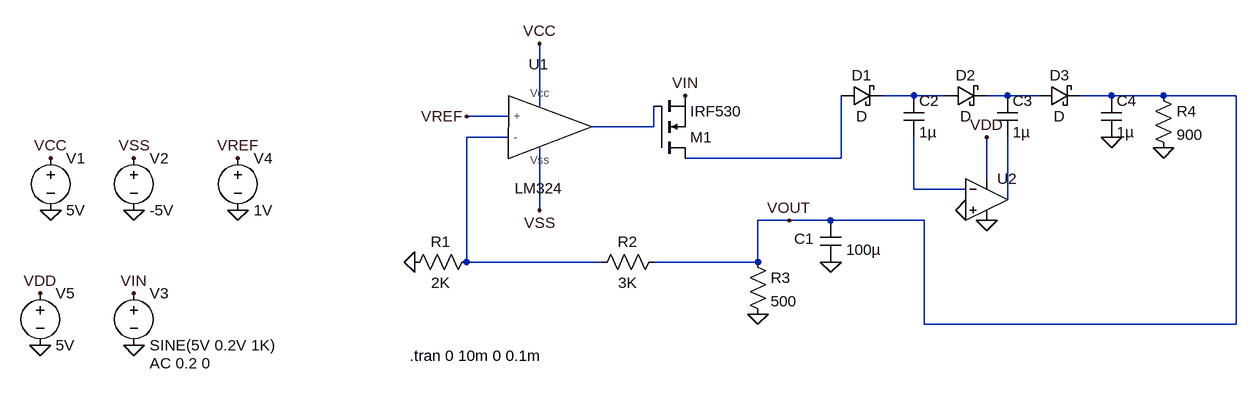
[diagram p0: schematic BAI 7 CHUAN BI 3.asc]
BAI 7 CHUAN BI 3.asc, the LTspice schematic file:
Version 4.1
SHEET 1 1780 680
WIRE 1280 -64 1232 -64
WIRE 1328 -64 1280 -64
WIRE 1424 -64 1392 -64
WIRE 1472 -64 1424 -64
WIRE 1584 -64 1536 -64
WIRE 1664 -64 1584 -64
WIRE 1776 -64 1664 -64
WIRE 704 -48 704 -144
WIRE 656 -32 592 -32
WIRE 880 -16 880 -48
WIRE 880 -16 784 -16
WIRE 656 0 592 0
WIRE 1168 32 1168 -64
WIRE 1168 32 928 32
WIRE 1392 64 1392 0
WIRE 1280 80 1280 0
WIRE 1360 80 1280 80
WIRE 1424 96 1424 0
WIRE 704 112 704 16
WIRE 1088 128 1040 128
WIRE 1152 128 1088 128
WIRE 1296 128 1152 128
WIRE 592 192 592 0
WIRE 800 192 592 192
WIRE 1040 192 1040 128
WIRE 1040 192 880 192
WIRE 1296 288 1296 128
WIRE 1776 288 1776 -64
WIRE 1776 288 1296 288
FLAG -48 112 0
FLAG -64 320 0
FLAG 80 320 0
FLAG 80 112 0
FLAG 240 112 0
FLAG -48 32 VCC
FLAG 80 32 VSS
FLAG 240 32 VREF
FLAG -64 240 VDD
FLAG 80 240 VIN
FLAG 512 192 0
FLAG 592 -32 VREF
FLAG 704 -144 VCC
FLAG 704 112 VSS
FLAG 1040 272 0
FLAG 1152 192 0
FLAG 1088 128 VOUT
FLAG 928 -64 VIN
FLAG 1584 0 0
FLAG 1664 16 0
FLAG 1392 0 VDD
FLAG 1392 128 0
FLAG 1360 112 0
SYMBOL voltage -48 16 R0
SYMATTR InstName V1
SYMATTR Value 5V
SYMBOL voltage 80 16 R0
SYMATTR InstName V2
SYMATTR Value -5V
SYMBOL voltage 80 224 R0
WINDOW 123 24 124 Left 2
WINDOW 39 0 0 Left 0
SYMATTR Value2 AC 0.2 0
SYMATTR InstName V3
SYMATTR Value SINE(5V 0.2V 1K)
SYMBOL voltage 240 16 R0
SYMATTR InstName V4
SYMATTR Value 1V
SYMBOL voltage -64 224 R0
SYMATTR InstName V5
SYMATTR Value 5V
SYMBOL res 496 208 R270
WINDOW 0 32 56 VTop 2
WINDOW 3 0 56 VBottom 2
SYMATTR InstName R1
SYMATTR Value 2K
SYMBOL LM324 704 -16 R0
SYMATTR InstName U1
SYMBOL res 896 176 R90
WINDOW 0 0 56 VBottom 2
WINDOW 3 32 56 VTop 2
SYMATTR InstName R2
SYMATTR Value 3K
SYMBOL res 1024 176 R0
SYMATTR InstName R3
SYMATTR Value 500
SYMBOL cap 1136 128 R0
WINDOW 0 -40 28 Left 2
WINDOW 3 40 45 Left 2
SYMATTR InstName C1
SYMATTR Value 100µ
SYMBOL nmos 880 32 M180
SYMATTR InstName M1
SYMATTR Value IRF530
SYMBOL schottky 1168 -48 R270
WINDOW 0 32 32 VTop 2
WINDOW 3 0 32 VBottom 2
SYMATTR InstName D1
SYMBOL cap 1264 -64 R0
SYMATTR InstName C2
SYMATTR Value 1µ
SYMBOL cap 1568 -64 R0
SYMATTR InstName C4
SYMATTR Value 1µ
SYMBOL res 1648 -80 R0
SYMATTR InstName R4
SYMATTR Value 900
SYMBOL cap 1408 -64 R0
SYMATTR InstName C3
SYMATTR Value 1µ
SYMBOL schottky 1328 -48 R270
WINDOW 0 32 32 VTop 2
WINDOW 3 0 32 VBottom 2
SYMATTR InstName D2
SYMBOL schottky 1472 -48 R270
WINDOW 0 32 32 VTop 2
WINDOW 3 0 32 VBottom 2
SYMATTR InstName D3
SYMBOL OpAmps\\UniversalOpAmp2 1392 96 R0
SYMATTR InstName U2
TEXT 504 336 Left 2 !.tran 0 10m 0 0.1m

The netlist it stands for:
* BAI 7 CHUAN BI 3.asc
V1 VCC 0 5V
V2 VSS 0 -5V
V3 VIN 0 SINE(5V 0.2V 1K) AC 0.2 0
V4 VREF 0 1V
V5 VDD 0 5V
R1 0 N004 2K
X§U1 VREF N004 VCC VSS N003 LM324  ; pins + - Vcc Vss ?
R2 VOUT N004 3K
R3 VOUT 0 500
C1 VOUT 0 100µ
M1 N005 N003 VIN VIN IRF530
D1 N005 N001 D
C2 N001 N006 1µ
C4 VOUT 0 1µ
R4 VOUT 0 900
C3 N002 N007 1µ
D2 N001 N002 D
D3 N002 VOUT D
X§U2 0 N006 VDD 0 N007 level2 Avol=1Meg GBW=10Meg Slew=10Meg Ilimit=25m Rail=0 Vos=0 En=0 Enk=0 In=0 Ink=0 Rin=500Meg  ; pins In+ In- V+ V- OUT
.model D D
.lib standard.dio
.model NMOS NMOS
.model PMOS PMOS
.lib standard.mos
.tran 0 10m 0 0.1m
.lib E:\ThiThucHanhCoHa\CoHa\LM324.cir
.lib UniversalOpAmp2.lib
.backanno
.end